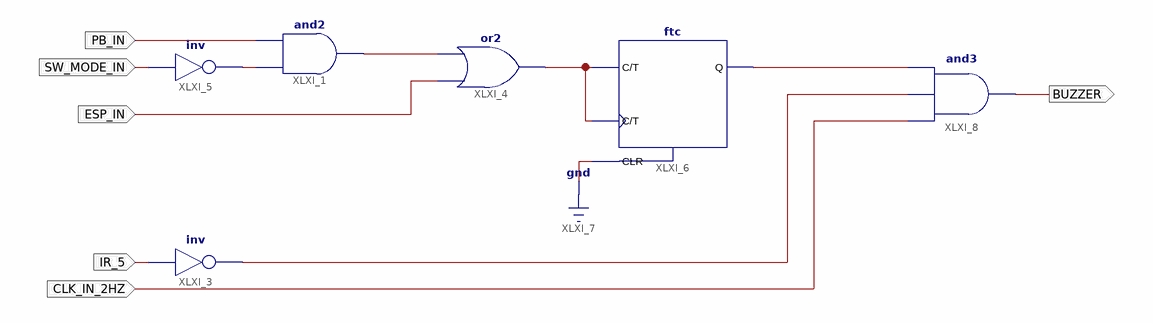
[diagram p0: schematic sheet 1]
// Xilinx ISE schematic Alarm_Garage.sch (spartan6) as structural Verilog: 6 symbols, 6 ports
module Alarm_Garage (
  input  PB_IN,
  input  SW_MODE_IN,
  input  ESP_IN,
  input  IR_5,
  input  CLK_IN_2HZ,
  output BUZZER
);

  wire XLXN_1, XLXN_4, XLXN_6, XLXN_9, XLXN_18;

  and XLXI_1 (XLXN_4, XLXN_1, PB_IN);
  not XLXI_5 (XLXN_1, SW_MODE_IN);
  or XLXI_4 (XLXN_6, ESP_IN, XLXN_4);
  ftc XLXI_6 (.C(XLXN_6), .CLR(1'b0), .T(XLXN_6), .Q(XLXN_18));
  and XLXI_8 (BUZZER, CLK_IN_2HZ, XLXN_9, XLXN_18);
  not XLXI_3 (XLXN_9, IR_5);
endmodule
